# EasyEDA schematic SCH_MVS_stero_mod_2026-03-16.json
TITLE: MV1-ZS stereo  + no-amp mod; REV: 1.0; Date: 2026-03-12; Sheet: 1/1; Company: BOICHOT
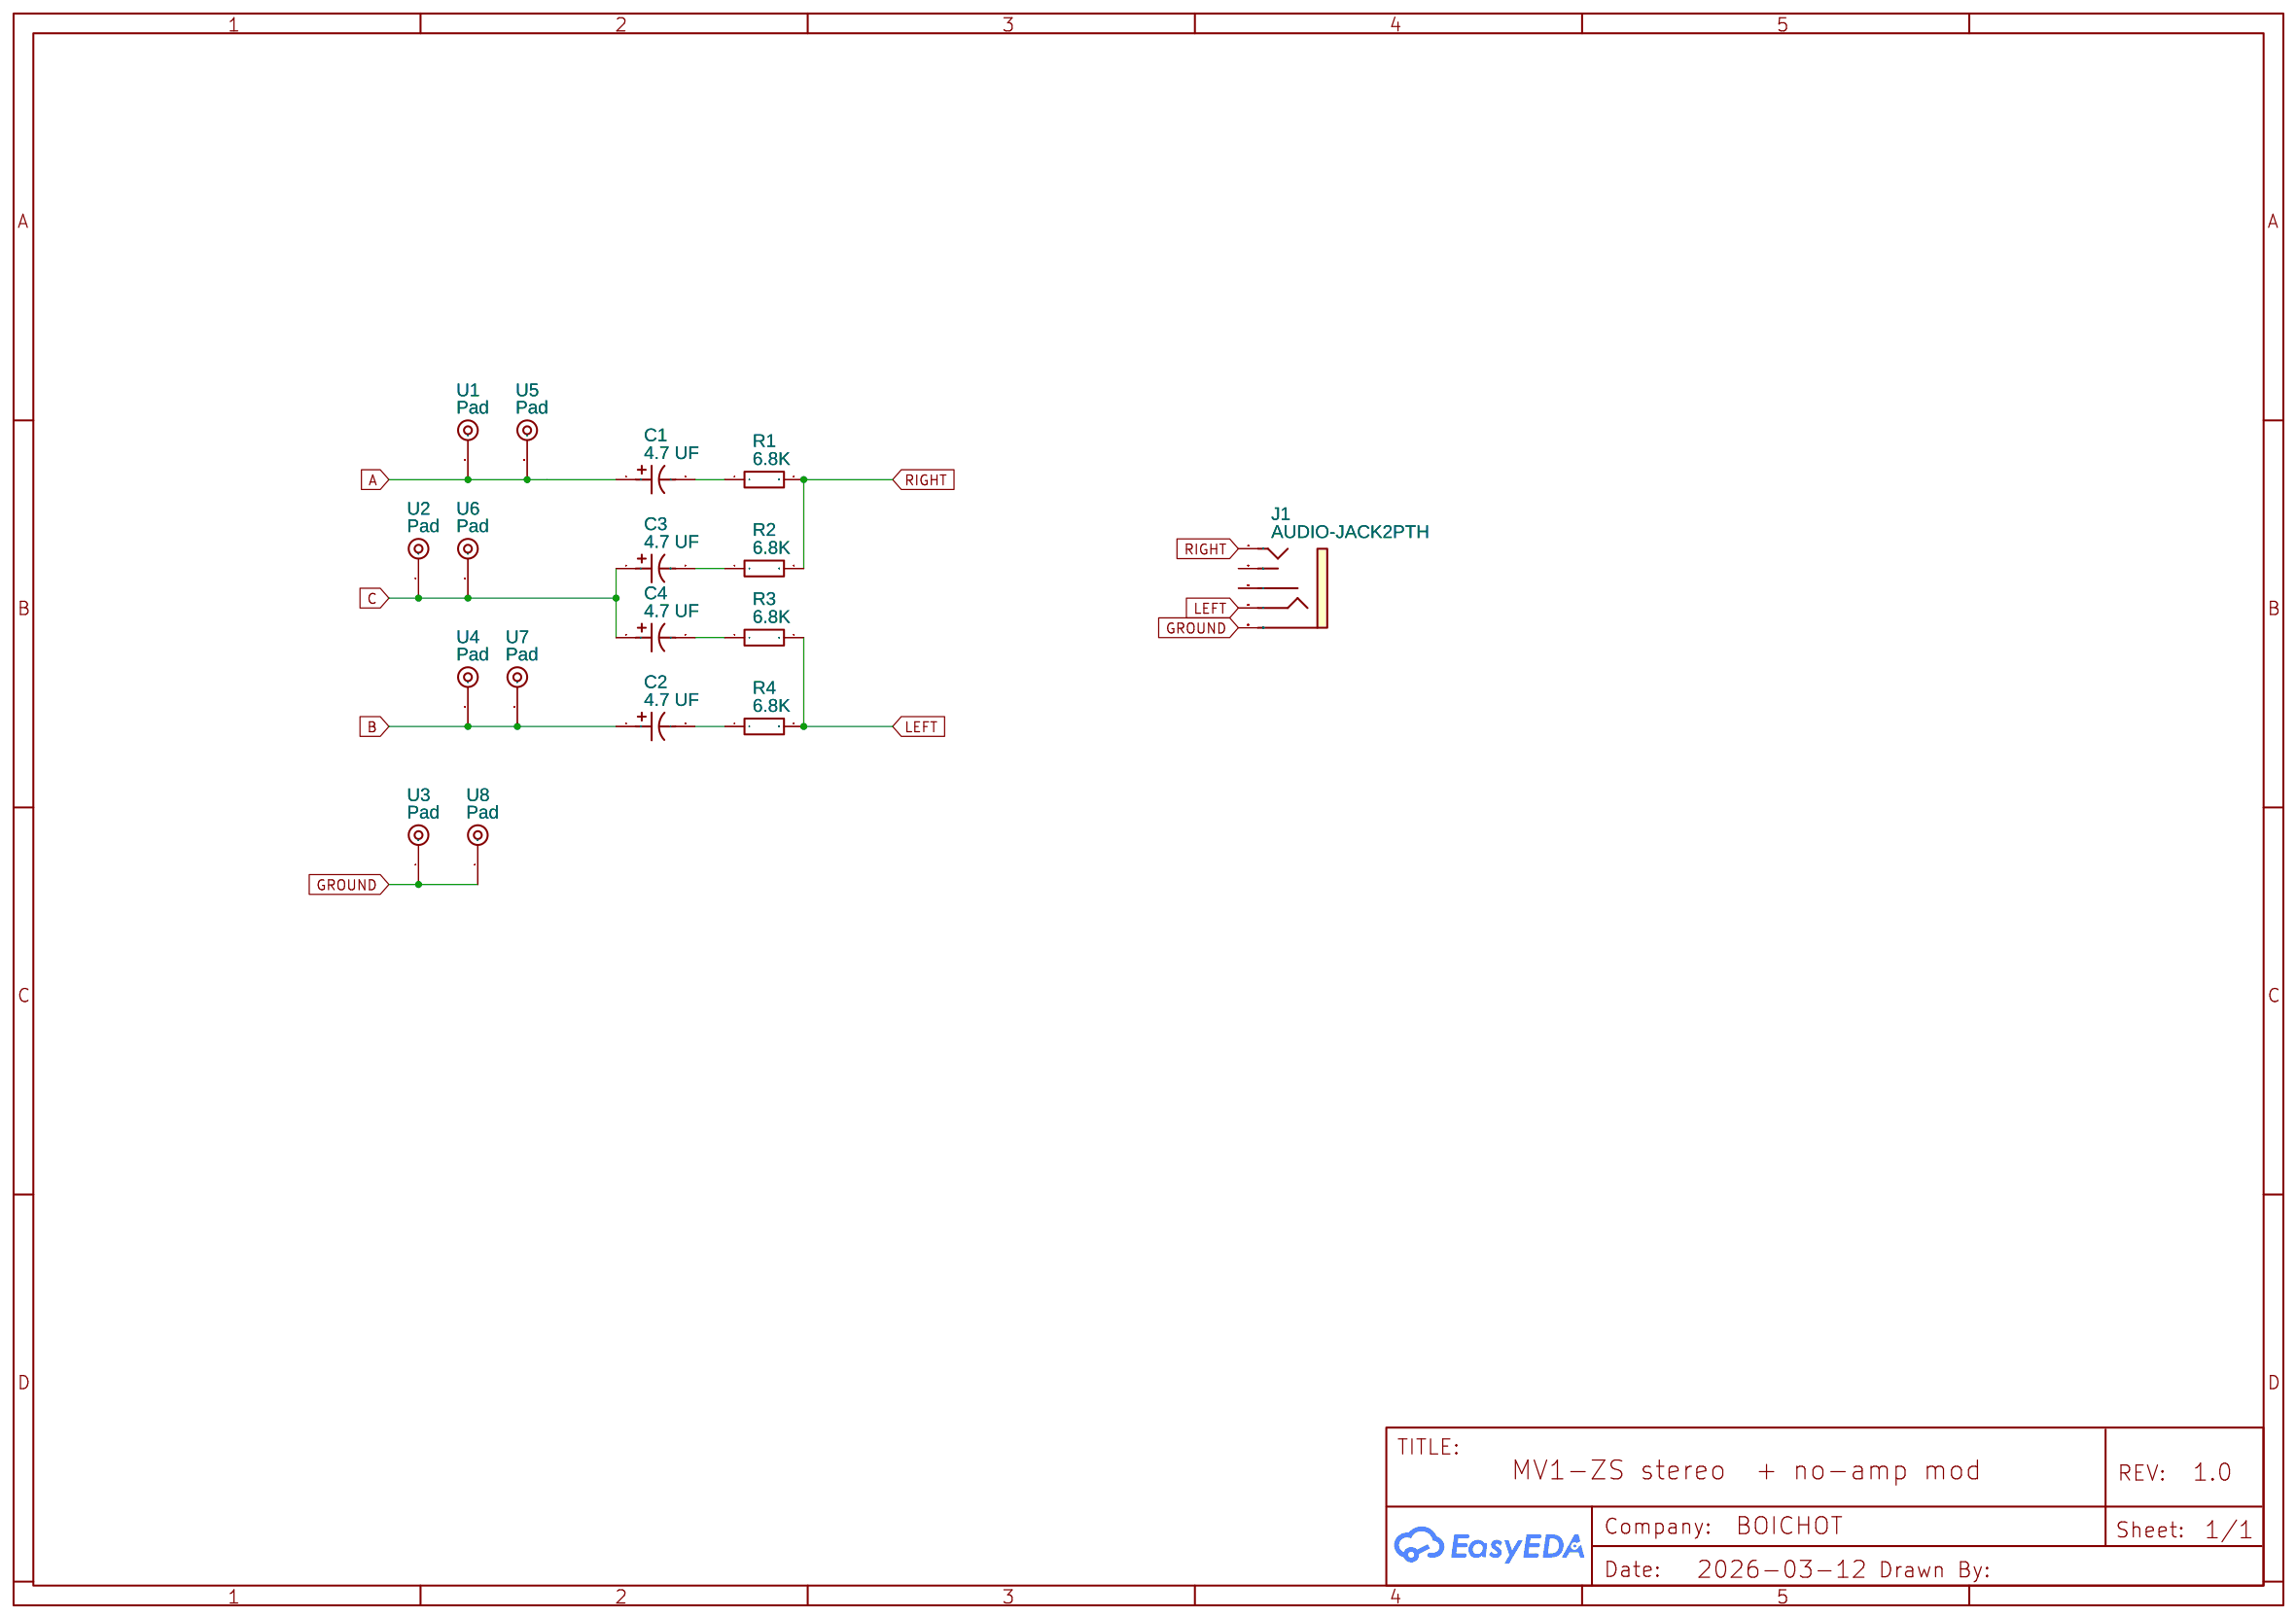
[diagram p0: schematic sheet]

## Parts
C1  4.7 UF  [CAP-TH_BD10.0-P5.00-D0.6-FD]
C2  4.7 UF  [CAP-TH_BD10.0-P5.00-D0.6-FD]
C3  4.7 UF  [CAP-TH_BD10.0-P5.00-D0.6-FD]
C4  4.7 UF  [CAP-TH_BD10.0-P5.00-D0.6-FD]
J1  AUDIO-JACK2PTH  [AUDIO-JACK]
R1  6.8K  [AXIAL-0.6]
R2  6.8K  [AXIAL-0.6]
R3  6.8K  [AXIAL-0.6]
R4  6.8K  [AXIAL-0.6]
U1  Pad  [CONNECTOR_PAD]
U2  Pad  [CONNECTOR_PAD]
U3  Pad  [CONNECTOR_PAD]
U4  Pad  [CONNECTOR_PAD]
U5  Pad  [CONNECTOR_PAD]
U6  Pad  [CONNECTOR_PAD]
U7  Pad  [CONNECTOR_PAD]
U8  Pad  [CONNECTOR_PAD]

## Library data of the parts
C1-C4 = BIPOLAR CAPACITOR 22,0 UF: Supplier: LCSC; Supplier Part: C6131732; Manufacturer: Visaton; JLCPCB Part Class: Extended Part; Contributor: lcsc
J1 = AUDIO-JACK2PTH: Stereo audio jack with bypass switches.; Contributor: SparkFun
R1-R4 = RESISTOR 1/2 W: Supplier: LCSC; Supplier Part: C348838; Manufacturer: ResistorToday; Manufacturer Part: EWWR0001J20R0T9; Contributor: LCSC
U1-U8 = Connector_pad_1: Contributor: SuperSuper

## Nets
A: C1.1 U1.1 U5.1
B: C2.1 U4.1 U7.1
C: C3.1 C4.1 U2.1 U6.1
GROUND: J1.SLEEVE U3.1 U8.1
LEFT: J1.RING R3.2 R4.2
RIGHT: J1.TIP R1.2 R2.2
Net-(C1-2): C1.2 R1.1
Net-(C2-2): C2.2 R4.1
Net-(C3-2): C3.2 R2.1
Net-(C4-2): C4.2 R3.1

Not connected (* = marked no-connect by the designer): J1 RSH TSH
